# EasyEDA Pro project Indicador de 8 bits.eprj

# Schematic Schematic1
Board Name: Board1; Create Date: 2025-01-23; Page Name: P1; Project Name: Indicador de 8 bits; Schematic Name: Schematic1; Update Date: 2025-01-23; Company: EasyEDA.com; Page Size: A4; Version: V1.0
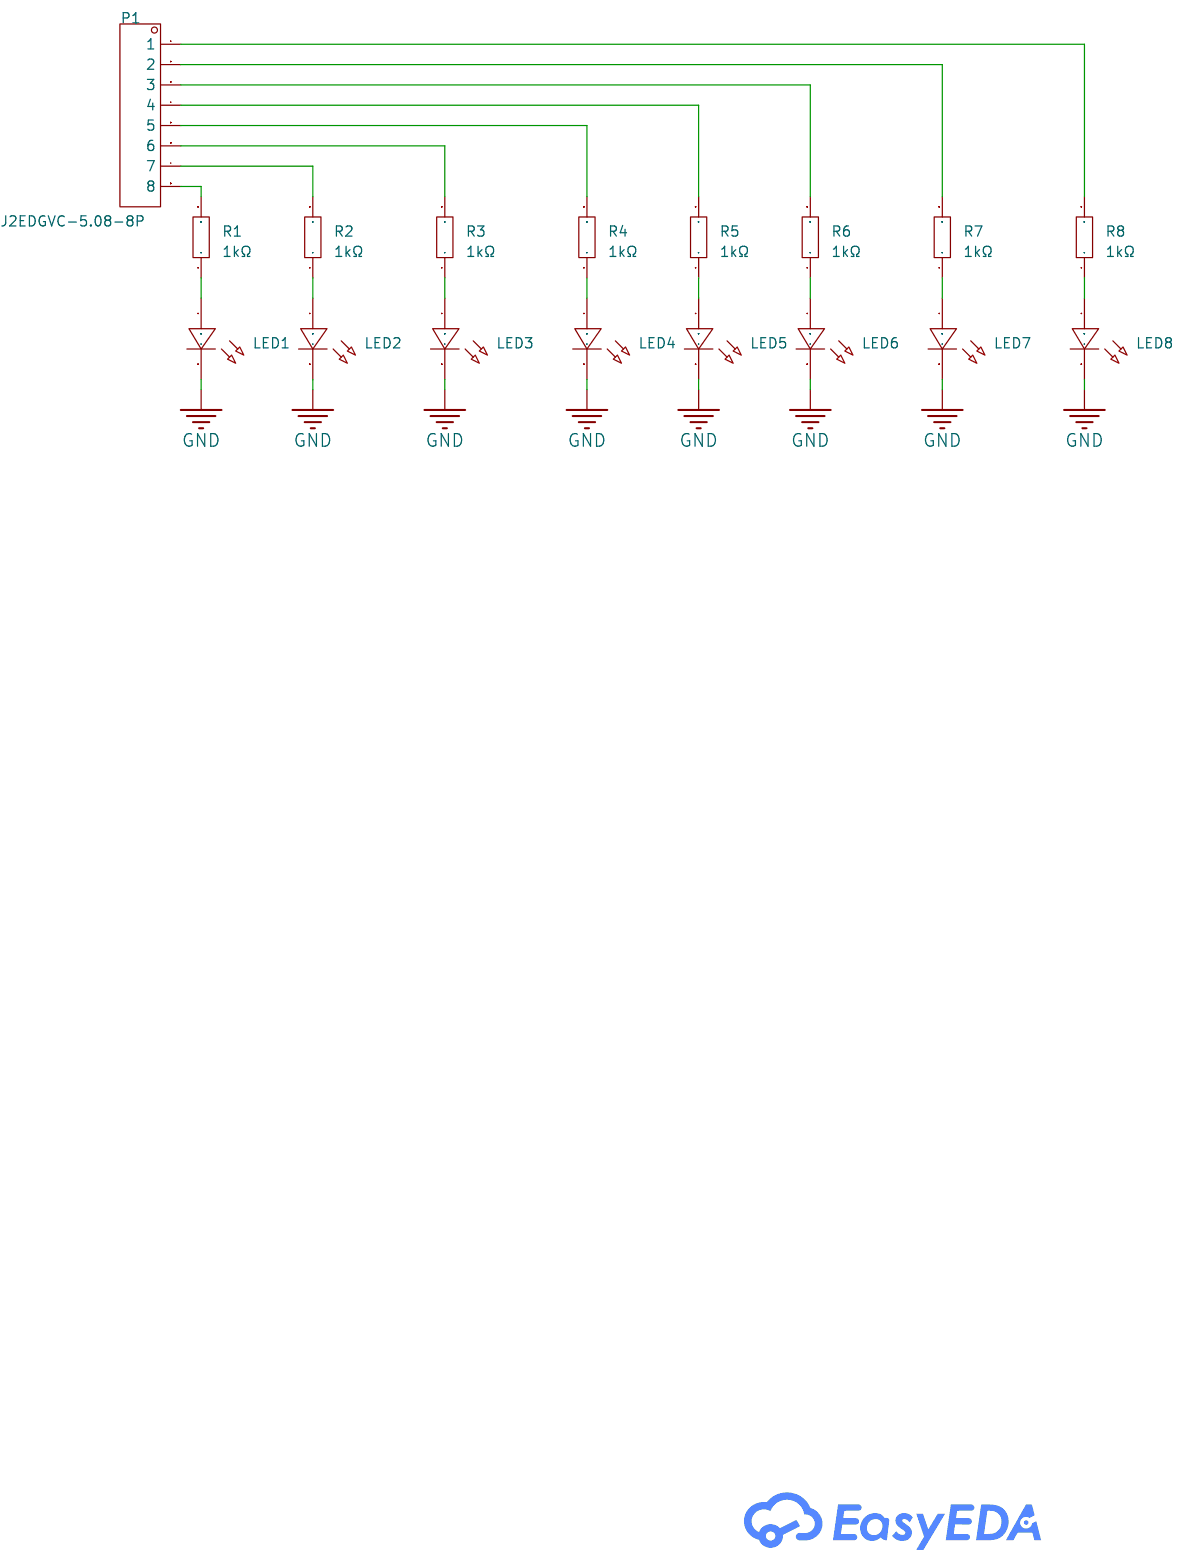
[diagram p0: schematic sheet]

## Parts
LED1  -  [LED-TH_BD5.8-P2.54-RD]
LED2  -  [LED-TH_BD5.8-P2.54-RD]
LED3  -  [LED-TH_BD5.8-P2.54-RD]
LED4  -  [LED-TH_BD5.8-P2.54-RD]
LED5  -  [LED-TH_BD5.8-P2.54-RD]
LED6  -  [LED-TH_BD5.8-P2.54-RD]
LED7  -  [LED-TH_BD5.8-P2.54-RD]
LED8  -  [LED-TH_BD5.8-P2.54-RD]
P1  WJ2EDGVC-5.08-8P  [CONN-TH_8P_WJ2EDGVC-5.08-8P]
R1  1kΩ  [R_AXIAL-0.4]
R2  1kΩ  [R_AXIAL-0.4]
R3  1kΩ  [R_AXIAL-0.4]
R4  1kΩ  [R_AXIAL-0.4]
R5  1kΩ  [R_AXIAL-0.4]
R6  1kΩ  [R_AXIAL-0.4]
R7  1kΩ  [R_AXIAL-0.4]
R8  1kΩ  [R_AXIAL-0.4]

## Library data of the parts
LED1-LED8 = LED_TH-G_5mm: Supplier Footprint: Through
P1 = WJ2EDGVC-5.08-8P: LCSC Part Name: 1x8P 5.08mm 排数:1 每排P数:8; Supplier Part: C15084; Manufacturer: KANGNEX(康奈克斯电气); Supplier Footprint: 插件,P=5.08mm; JLCPCB Part Class: Extended Part; Datasheet: https://atta.szlcsc.com/upload/public/pdf/source/20191225/C15084_DD9E3C5EAD1F3B7CC33CEFC49740A342.pdf; Supplier: LCSC; Connector Type: Receptacle-Close; Structure: 1x8P; Pitch: 5.08mm; Color: Green; Mounting Style: Straight Needle; Number of Pins: 8P; Number of Rows: 1; Number of PINs Per Row: 8; Current Rating (Max): 20A; Voltage Rating (Max): 450V; Contact Material: Brass; Contact Plating: Tin; Operating Temperature Range: -40℃~+105℃
R1-R8 = Res_AXIAL-1/4W: Supplier Footprint: Through

## Nets
GND: LED1.2(A) LED2.2(A) LED3.2(A) LED4.2(A) LED5.2(A) LED6.2(A) LED7.2(A) LED8.2(A)
$1N320: LED1.1(C) R1.1
$1N325: P1.8 R1.2
$1N456: LED2.1(C) R2.1
$1N520: LED3.1(C) R3.1
$1N586: LED4.1(C) R4.1
$1N828: LED5.1(C) R5.1
$1N837: LED7.1(C) R7.1
$1N839: LED6.1(C) R6.1
$1N843: LED8.1(C) R8.1
$1N860: P1.7 R2.2
$1N865: P1.6 R3.2
$1N874: P1.5 R4.2
$1N880: P1.4 R5.2
$1N886: P1.3 R6.2
$1N892: P1.2 R7.2
$1N898: P1.1 R8.2

# Board PCB1
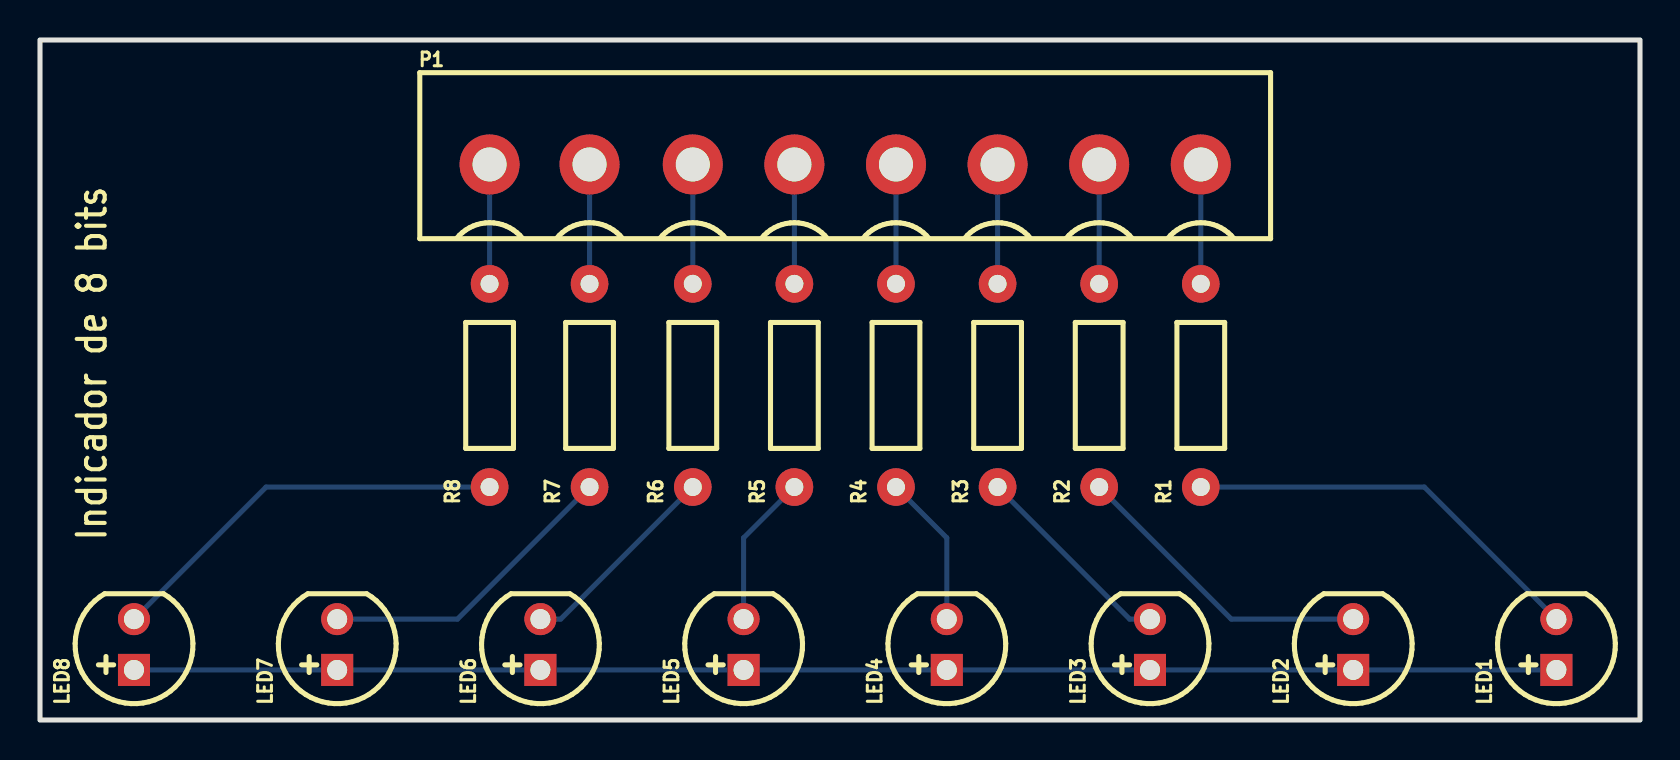
[diagram p1: board, top side]
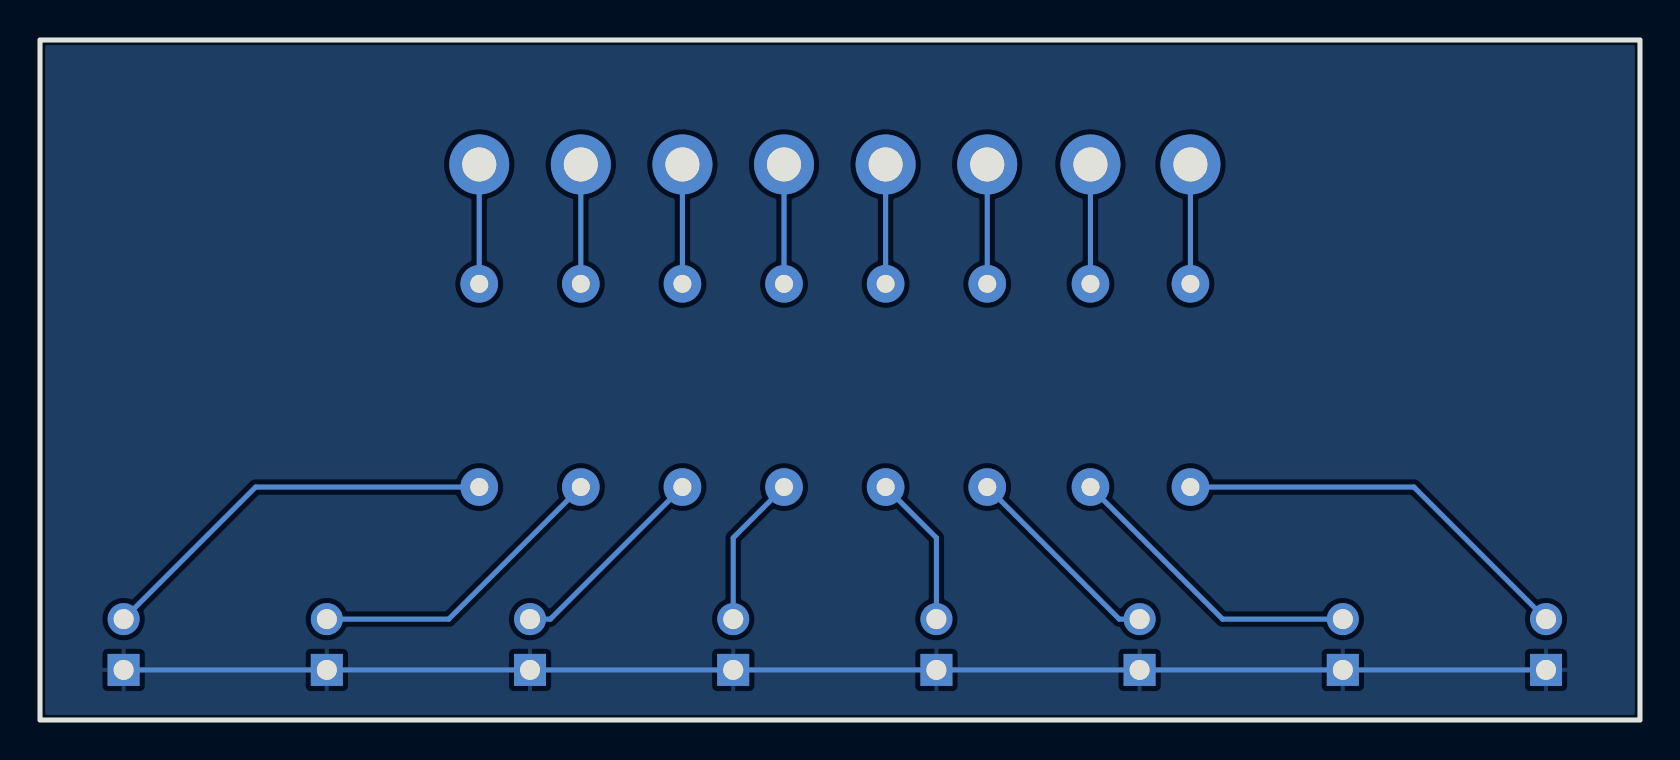
[diagram p2: board, bottom side, seen from below]

Outline 80 x 34 mm; copper layers: Top Layer, Bottom Layer. Coordinates in mm from the lower left corner of the outline.
Outline path: rectangle 0,34 80,0
Stack: Top Layer 0.035mm / Dielectric1 1.51mm FR4 er 4.5 / Bottom Layer 0.035mm

## Design rules (mm)
template: JLCPCB Capability(Two Layers Board)
spacing copperThickness1oz (default): track to track 0.102, other pairs 0.152 to 0.3
spacing copperThickness2oz: track to track 0.203, other pairs 0.152 to 0.3
track width copperThickness1oz (default): min 0.127, default 0.254, max 2.54
track width copperThickness2oz: min 0.203, default 0.254, max 2.54
differential pair differentialPair (default): width min 0.127, default 0.254, max 2.54; gap min 0.152, default 0.152
via viaSize (default): diameter min 0.5, default 0.61, max 10; hole min 0.3, default 0.305, max 6.3

## Placement (name value [footprint] x y rotation side)
LED1  -  [LED-TH_BD5.8-P2.54-RD]  75.82 3.77 90 top
LED2  -  [LED-TH_BD5.8-P2.54-RD]  65.66 3.77 90 top
LED3  -  [LED-TH_BD5.8-P2.54-RD]  55.5 3.77 90 top
LED4  -  [LED-TH_BD5.8-P2.54-RD]  45.34 3.77 90 top
LED5  -  [LED-TH_BD5.8-P2.54-RD]  35.18 3.77 90 top
LED6  -  [LED-TH_BD5.8-P2.54-RD]  25.02 3.77 90 top
LED7  -  [LED-TH_BD5.8-P2.54-RD]  14.86 3.77 90 top
LED8  -  [LED-TH_BD5.8-P2.54-RD]  4.7 3.77 90 top
P1  WJ2EDGVC-5.08-8P  [CONN-TH_8P_WJ2EDGVC-5.08-8P]  40.26 27.78 0 top
R1  1kΩ  [R_AXIAL-0.4]  58.04 16.73 90 top
R2  1kΩ  [R_AXIAL-0.4]  52.96 16.73 90 top
R3  1kΩ  [R_AXIAL-0.4]  47.88 16.73 90 top
R4  1kΩ  [R_AXIAL-0.4]  42.8 16.73 90 top
R5  1kΩ  [R_AXIAL-0.4]  37.72 16.73 90 top
R6  1kΩ  [R_AXIAL-0.4]  32.64 16.73 90 top
R7  1kΩ  [R_AXIAL-0.4]  27.48 16.73 90 top
R8  1kΩ  [R_AXIAL-0.4]  22.48 16.73 90 top

## Footprints (pads in the part's own frame, mm; a bottom-side part is the same pattern mirrored in y, then rotated)
CONN-TH_8P_WJ2EDGVC-5.08-8P
  round 3 hole 1.7: 1(-17.78,0) 2(-12.781,0) 3(-7.62,0) 4(-2.54,0) 5(2.54,0) 6(7.62,0) 7(12.7,0) 8(17.78,0)
LED-TH_BD5.8-P2.54-RD
  round 1.6 hole 1: 1(1.27,0)
  rect 1.6x1.6 hole 1: 2(-1.27,0)
R_AXIAL-0.4
  round 1.879 hole 0.899: 1(-5.08,0) 2(5.08,0)

## Nets
As in the schematic.

## Routing (per net, layer and track width the routed paths; a pad name or vN(x,y) marks a point on that pad's centre or on a via; arc(x,y) is an arc through that point)
GND: length 71.1
  Bottom Layer w0.254: LED8.2 LED7.2 LED6.2 LED5.2 LED4.2 LED3.2 LED2.2 LED1.2
$1N320: length 20.5
  Bottom Layer w0.254: LED1.1 69.21,11.65 R1.1
$1N325: length 6
  Bottom Layer w0.254: P1.8 R1.2
$1N456: length 15.4
  Bottom Layer w0.254: LED2.1 59.56,5.04 R2.1
$1N520: length 10.4
  Bottom Layer w0.254: R3.1 54.48,5.04 LED3.1
$1N586: length 7.7
  Bottom Layer w0.254: LED4.1 45.34,9.11 R4.1
$1N828: length 7.7
  Bottom Layer w0.254: LED5.1 35.18,9.11 R5.1
$1N837: length 15.4
  Bottom Layer w0.254: LED7.1 20.87,5.04 R7.1
$1N839: length 10.4
  Bottom Layer w0.254: R6.1 26.04,5.04 LED6.1
$1N843: length 20.5
  Bottom Layer w0.254: LED8.1 11.3,11.65 R8.1
$1N860: length 6
  Bottom Layer w0.254: P1.7 R2.2
$1N865: length 6
  Bottom Layer w0.254: P1.6 R3.2
$1N874: length 6
  Bottom Layer w0.254: P1.5 R4.2
$1N880: length 6
  Bottom Layer w0.254: P1.4 R5.2
$1N886: length 6
  Bottom Layer w0.254: P1.3 R6.2
$1N892: length 6
  Bottom Layer w0.254: P1.2 R7.2
$1N898: length 6
  Bottom Layer w0.254: P1.1 R8.2

## Copper pours and planes (outline as drawn; the poured copper is in the pictures)
GND on Bottom Layer: -3.17,36.79 85.73,36.79 85.73,-4.35 -3.17,-4.35

## Text on the board
Top Silkscreen Layer: Indicador de 8 bits
